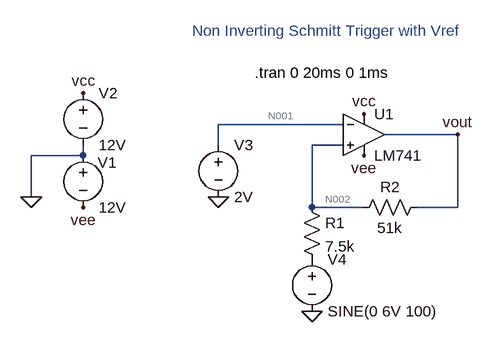
[diagram p0: schematic non_inverting_schmitt_trigger_with_vref.asc]
non_inverting_schmitt_trigger_with_vref.asc, the LTspice schematic file:
Version 4.1
SHEET 1 880 680
WIRE 128 304 -64 304
WIRE 304 320 192 320
WIRE -64 336 -64 304
WIRE 128 336 80 336
WIRE -272 352 -272 336
WIRE -272 352 -352 352
WIRE -352 416 -352 352
WIRE 80 432 80 336
WIRE 160 432 80 432
WIRE 304 432 304 320
WIRE 304 432 240 432
FLAG -352 416 0
FLAG -272 256 vcc
FLAG -272 432 vee
FLAG 160 288 vcc
FLAG 160 352 vee
FLAG -64 416 0
FLAG 304 320 vout
FLAG 80 592 0
SYMBOL voltage -272 336 R0
WINDOW 0 22 27 Left 2
WINDOW 123 0 0 Left 0
WINDOW 39 0 0 Left 0
SYMATTR InstName V1
SYMATTR Value 12V
SYMBOL voltage -272 240 R0
WINDOW 123 0 0 Left 0
WINDOW 39 0 0 Left 0
SYMATTR InstName V2
SYMATTR Value 12V
SYMBOL LM741 160 256 R0
SYMATTR InstName U1
SYMBOL voltage -64 320 R0
WINDOW 123 0 0 Left 0
WINDOW 39 0 0 Left 0
SYMATTR InstName V3
SYMATTR Value 2V
SYMBOL res 64 416 R0
SYMATTR InstName R1
SYMATTR Value 7.5k
SYMBOL res 256 416 R90
WINDOW 0 0 56 VBottom 2
WINDOW 3 32 56 VTop 2
SYMATTR InstName R2
SYMATTR Value 51k
SYMBOL voltage 80 496 R0
WINDOW 123 0 0 Left 0
WINDOW 39 0 0 Left 0
SYMATTR InstName V4
SYMATTR Value SINE(0 6V 100)
TEXT -104 160 Left 2 ;Non Inverting Schmitt Trigger with Vref
TEXT -8 224 Left 2 !.tran 0 20ms 0 1ms

The netlist it stands for:
* non_inverting_schmitt_trigger_with_vref.asc
V1 0 vee 12V
V2 vcc 0 12V
X§U1 N002 N001 vcc vee vout LM741  ; pins In+ In- V+ V- OUT
V3 N001 0 2V
R1 N002 P001 7.5k
R2 vout N002 51k
V4 P001 0 SINE(0 6V 100)
* Non Inverting Schmitt Trigger with Vref
.tran 0 20ms 0 1ms
.lib LM741.lib
.backanno
.end

* Results of the author's LTspice run, read from the files saved beside the schematic
* Operating Point, zero values left out:
*   V(vcc) = 12 V
*   V(n001) = 2 V
*   V(vout) = -11 V
*   V(vee) = -12 V
*   V(n002) = -1.366 V
*   I(V1) = -1.656 mA
*   I(R1) = -182.1 µA
*   I(V4) = -182.1 µA
*   I(R2) = -188.8 µA
*   I(V2) = -1.467 mA
*   I(V3) = -6.911 µA
*   Ix(u1:1) = -6.751 µA
*   Ix(u1:2) = 6.911 µA
*   Ix(u1:99) = 1.467 mA
*   Ix(u1:50) = -1.656 mA
*   Ix(u1:28) = 188.8 µA
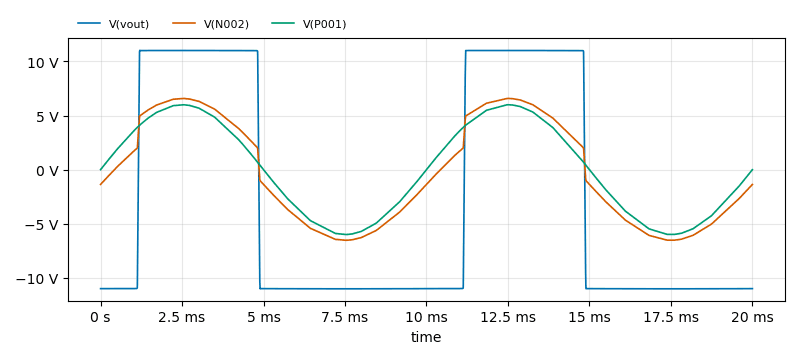
[diagram p1: Transient Analysis of non_inverting_schmitt_trigger_with_vref.asc, plotted from the saved traces]
* Transient Analysis, 1 run:
*   V(vout): min -11.01 V, max 11.02 V, average -2.878 V, rms 10.96 V, last -11 V
*   V(N002): min -6.529 V, max 6.581 V, average -334.7 mV, rms 4.811 V, last -1.366 V
*   V(P001): min -5.998 V, max 5.999 V, average 4.612 mV, rms 4.247 V, last 0 V